# Altium schematic sheet Opamps.SchDoc
size A4; SheetNumber: 3; SheetTotal: 7
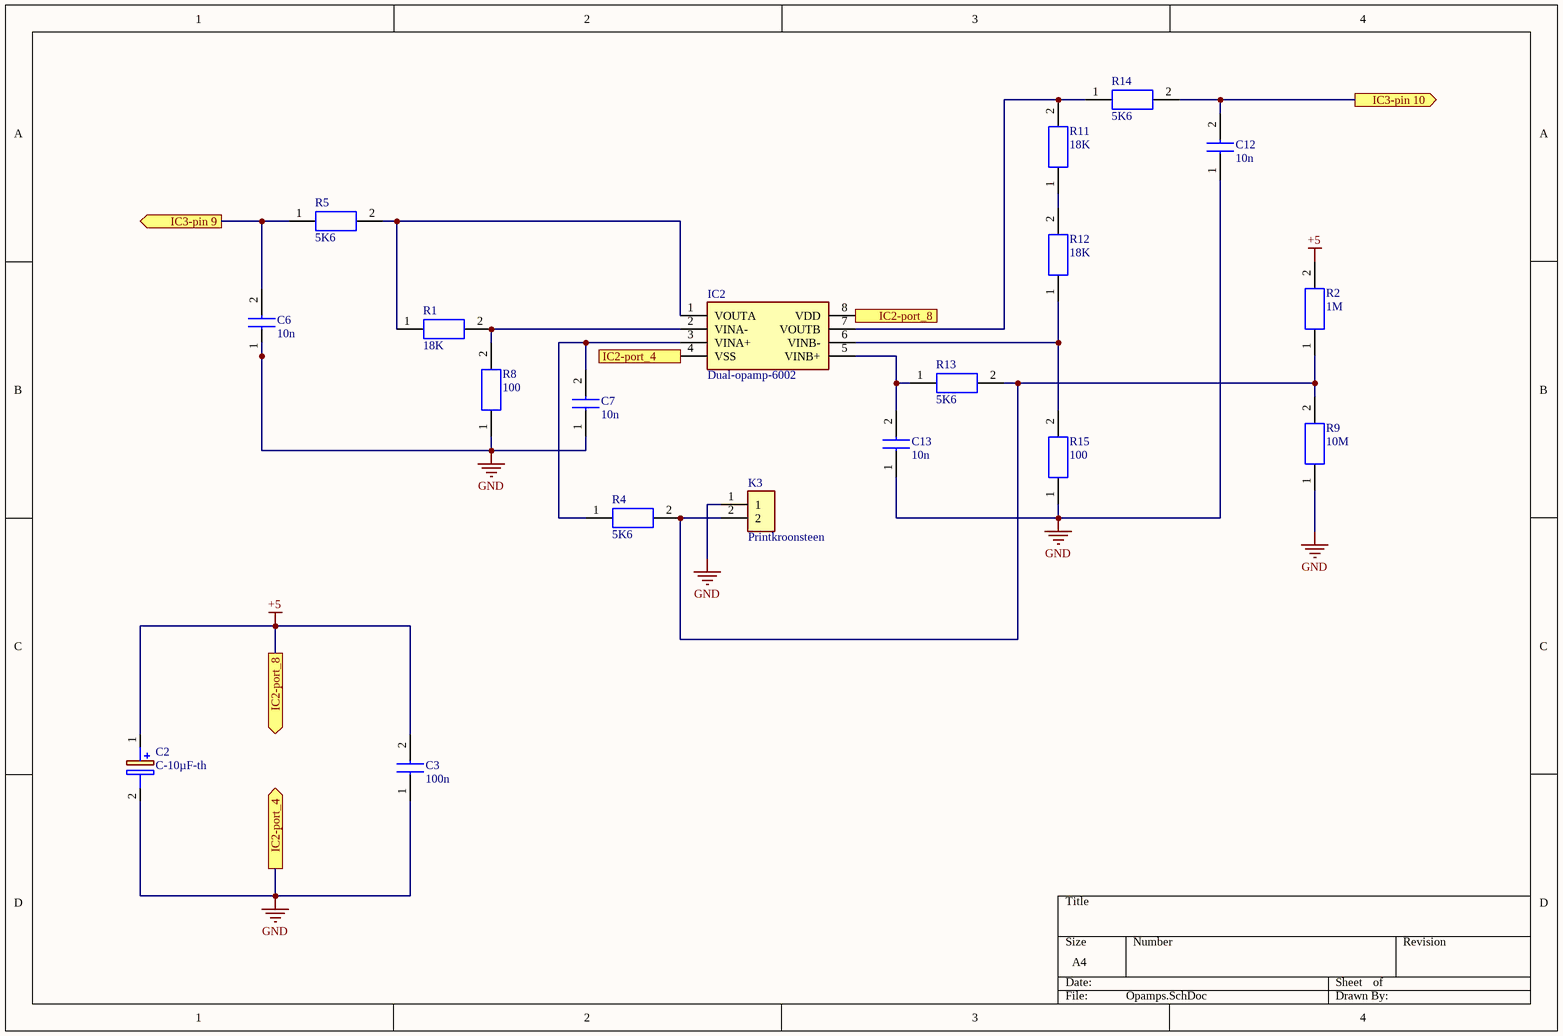
[diagram p0: Opamps.SchDoc]

## Parts
C2  C-10µF-th  [C-10µF-th]
C3  100n  [C-0805-smd]
C6  10n  [C-0805-smd]
C7  10n  [C-0805-smd]
C12  10n  [C-0805-smd]
C13  10n  [C-0805-smd]
IC2  Dual-opamp-6002  [Dual-opamp-6002]
K3  Printkroonsteen  [Printkroonsteen]
R1  18K  [R-0805]
R2  1M  [R-0805]
R4  5K6  [R-0805]
R5  5K6  [R-0805]
R8  100  [R-0805]
R9  10M  [R-0805]
R11  18K  [R-0805]
R12  18K  [R-0805]
R13  5K6  [R-0805]
R14  5K6  [R-0805]
R15  100  [R-0805]

## Ports
IC2-port_4 (in), IC2-port_4 (out), IC2-port_8 (in), IC2-port_8 (out), IC3-pin 9 (out), IC3-pin 10 (out)

## Nets
+5: C2.1(+) C3.2 IC2.8(VDD) R2.2 ; port IC2-port_8
GND: C2.2(-) C3.1 C6.1 C7.1 C12.1 C13.1 IC2.4(VSS) K3.1 R8.1 R9.1 R15.1 ; port IC2-port_4
IC3-pin 9: C6.2 R5.1 ; port IC3-pin 9
IC3-pin 10: C12.2 R14.2 ; port IC3-pin 10
NetC7_2: C7.2 IC2.3(VINA+) R4.1
NetC13_2: C13.2 IC2.5(VINB+) R13.1
NetIC2_1: IC2.1(VOUTA) R1.1 R5.2
NetIC2_2: IC2.2(VINA-) R1.2 R8.2
NetIC2_6: IC2.6(VINB-) R12.1 R15.2
NetIC2_7: IC2.7(VOUTB) R11.2 R14.1
NetK3_2: K3.2 R2.1 R4.2 R9.2 R13.2
NetR11_1: R11.1 R12.2

## Library data of the parts
C2 = C-10µF-th: Capacitor Polarised; Manufacturer_Name: Panasonic; Manufacturer_Part_Number: ECA-1HM100I; Datasheet Link: https://componentsearchengine.com//ECA-1HM100I.pdf; Height: 12mm; Mouser2 Part Number: 667-ECA-1HM100I; Mouser2 Price/Stock: https://www.mouser.com/Search/Refine.aspx?Keyword=667-ECA-1HM100I
C3 C6 C7 C12 C13 = C-0805-smd: Capacitor; Manufacturer_Name: Kemet; Manufacturer_Part_Number: C0805C301G5GACTU; Datasheet Link: https://connect.kemet.com:7667/gateway/IntelliData-ComponentDocumentation/1.0/download/specsheet/C0805C301G5GACTU; Height: 0.88mm
IC2 = Dual-opamp-6002: Integrated Circuit; Manufacturer_Name: Microchip; Manufacturer_Part_Number: MCP6002-E/P; Datasheet Link: https://componentsearchengine.com//MCP6002-E_P.pdf; Height: 5.334mm; Mouser2 Part Number: 579-MCP6002-E/P; Mouser2 Price/Stock: https://www.mouser.com/Search/Refine.aspx?Keyword=579-MCP6002-E%2FP
K3 = Printkroonsteen: Connector; Manufacturer_Name: CUI Inc.; Manufacturer_Part_Number: TB007-508-02BE; Datasheet Link: https://componentsearchengine.com//TB007-508-02BE.pdf; Height: 14mm; Mouser2 Part Number: 490-TB007-508-02BE; Mouser2 Price/Stock: https://www.mouser.com/Search/Refine.aspx?Keyword=490-TB007-508-02BE
R1 R2 R4 R5 R8 R9 R11-R15 = R-0805: Resistor; Manufacturer_Name: Vishay; Manufacturer_Part_Number: TNPU0805500RAZEN00; Height: 0.55mm